# Altium schematic sheet Netscale48HD_RFID_Reader_Writer.SchDoc: RFID Reader Writer
size A3; Author: NK; CompanyName: Reichle & De-Massari; Organization: Reichle & De-Massari; Address1: Binzstrasse 32; Address2: 8620 Wetzikon; Address3: Switzerland; DocumentNumber: 4; Revision: V0.2; SheetNumber: 1; SheetTotal: 5; Organization1: Reichle & De-Massari; Size: A4; ShortDescription: MCU and RFID Reader
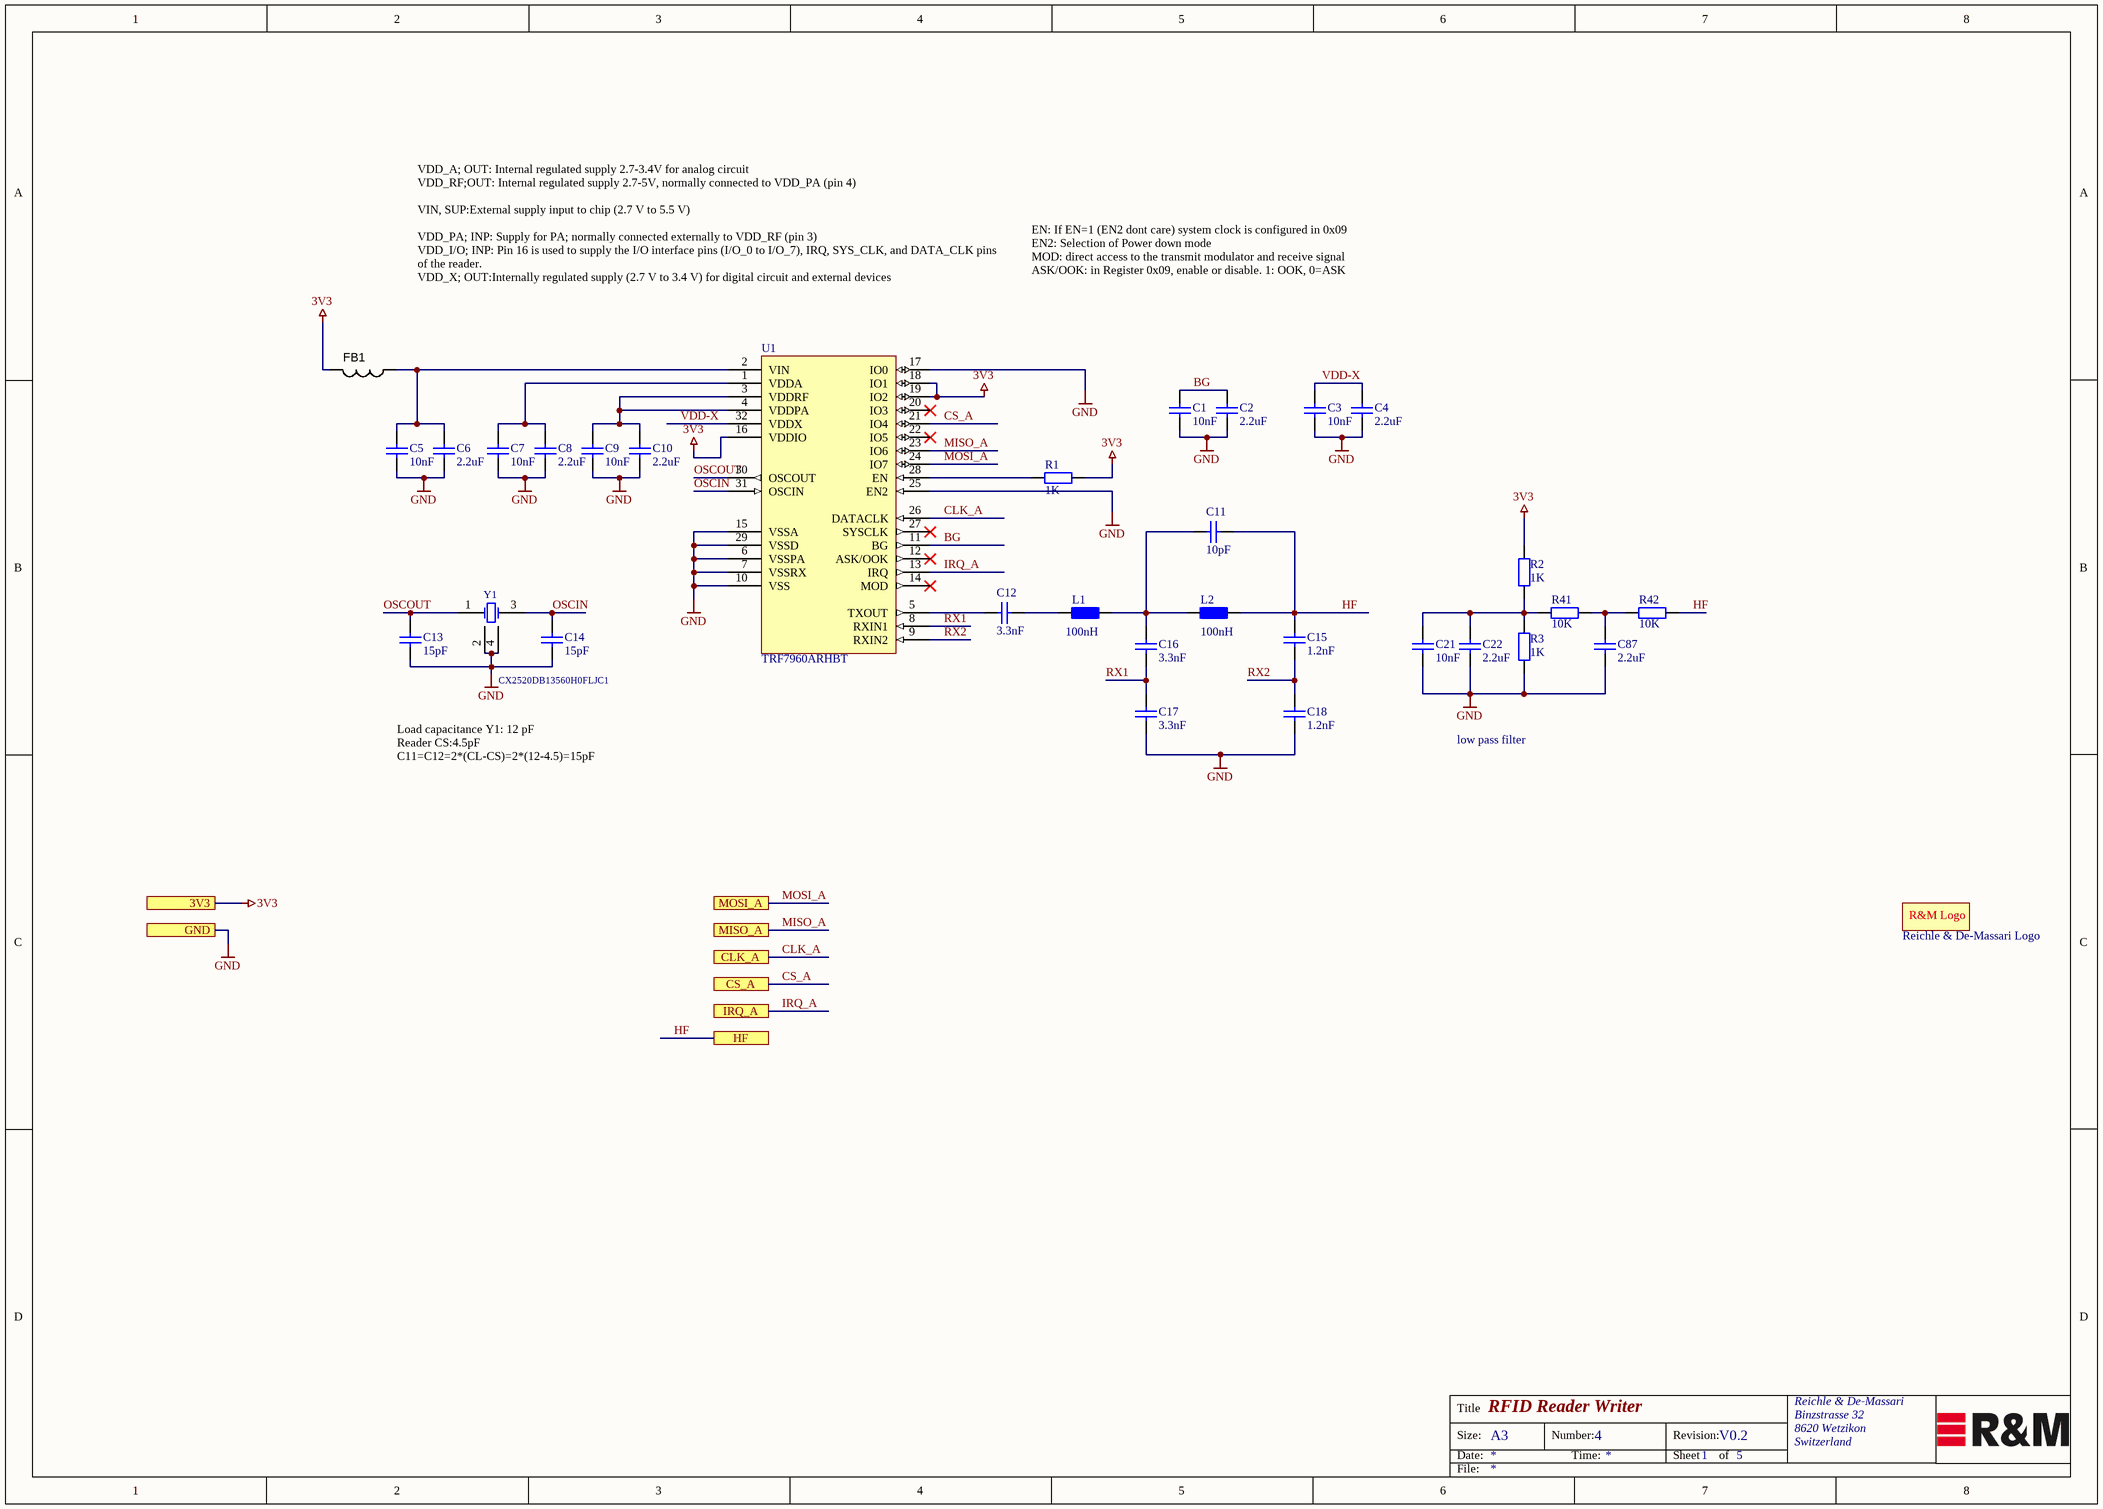
[diagram p0: Netscale48HD_RFID_Reader_Writer.SchDoc]

## Parts
*1  Reichle & De-Massari Logo  [SYMBOL_R&M]  (no BOM)
C1  10nF  [Ceramic Capacitor 0402 EIA]
C2  2.2uF  [Ceramic Capacitor 0402 EIA]
C3  10nF  [Ceramic Capacitor 0402 EIA]
C4  2.2uF  [Ceramic Capacitor 0402 EIA]
C5  10nF  [Ceramic Capacitor 0402 EIA]
C6  2.2uF  [Ceramic Capacitor 0402 EIA]
C7  10nF  [Ceramic Capacitor 0402 EIA]
C8  2.2uF  [Ceramic Capacitor 0402 EIA]
C9  10nF  [Ceramic Capacitor 0402 EIA]
C10  2.2uF  [Ceramic Capacitor 0402 EIA]
C11  10pF  [Ceramic Capacitor 0402 EIA]
C12  3.3nF  [Ceramic Capacitor 0402 EIA]
C13  15pF  [Ceramic Capacitor 0402 EIA]
C14  15pF  [Ceramic Capacitor 0402 EIA]
C15  1.2nF  [Ceramic Capacitor 0402 EIA]
C16  3.3nF  [Ceramic Capacitor 0402 EIA]
C17  3.3nF  [Ceramic Capacitor 0402 EIA]
C18  1.2nF  [Ceramic Capacitor 0402 EIA]
C21  10nF  [Ceramic Capacitor 0402 EIA]
C22  2.2uF  [Ceramic Capacitor 0402 EIA]
C87  2.2uF  [Ceramic Capacitor 0402 EIA]
FB1  BK1005HS102-T  [CAPC1005X55N]  (value not drawn)
L1  value 100nH  [Inductor 0603 EIA]  (hidden comment: HK1608R10J-T)
L2  value 100nH  [Inductor 0603 EIA]  (hidden comment: HK1608R10J-T)
R1  value 1K  [RESC1005X40N]  (hidden comment: RC0402FR-071KL)
R2  value 1K  [RESC1005X40N]  (hidden comment: RC0402FR-071KL)
R3  value 1K  [RESC1005X40N]  (hidden comment: RC0402FR-071KL)
R41  10K  [Resistor 0402 EIA]
R42  10K  [Resistor 0402 EIA]
U1  TRF7960ARHBT  [TexasInstruments_32-VFQFN_32_R]
Y1  CX2520DB13560H0FLJC1  [AVX/Kyocera_DFN4_4_RWH]

## Ports
3V3, CLK_A, CS_A, GND, HF, IRQ_A, MISO_A, MOSI_A

## Nets
3V3: FB1.2 R1.1 R2.1 U1.16(VDDIO) U1.18(IO1) U1.19(IO2) ; port 3V3
GND: C1.1 C2.1 C3.1 C4.1 C5.1 C6.1 C7.1 C8.1 C9.1 C10.1 C13.1 C14.1 C17.1 C18.1 C21.1 C22.1 C87.1 R3.2 U1.6(VSSPA) U1.7(VSSRX) U1.10(VSS) U1.15(VSSA) U1.17(IO0) U1.25(EN2) U1.29(VSSD) Y1.2(OSC2) Y1.4(OSC3) ; port GND
BG: C1.2 C2.2 U1.11(BG)
CLK_A: U1.26(DATACLK) ; port CLK_A
CS_A: U1.21(IO4) ; port CS_A
HF: C11.1 C15.2 L2.2 R42.2 ; port HF
IRQ_A: U1.13(IRQ) ; port IRQ_A
MISO_A: U1.23(IO6) ; port MISO_A
MOSI_A: U1.24(IO7) ; port MOSI_A
OSCIN: C14.2 U1.31(OSCIN) Y1.3(OSC2)
OSCOUT: C13.2 U1.30(OSCOUT) Y1.1(OSC1)
RX1: C16.1 C17.2 U1.8(RXIN1)
RX2: C15.1 C18.2 U1.9(RXIN2)
VDD-X: C3.2 C4.2 U1.32(VDDX)
NetC5_2: C5.2 C6.2 FB1.1 U1.2(VIN)
NetC7_2: C7.2 C8.2 U1.1(VDDA)
NetC9_2: C9.2 C10.2 U1.3(VDDRF) U1.4(VDDPA)
NetC11_2: C11.2 C16.2 L1.2 L2.1
NetC12_1: C12.1 L1.1
NetC12_2: C12.2 U1.5(TXOUT)
NetC21_2: C21.2 C22.2 R2.2 R3.1 R41.1
NetC87_2: C87.2 R41.2 R42.1
NetR1_2: R1.2 U1.28(EN)

Not connected (* = marked no-connect by the designer): U1 12(ASK/OOK)* 14(MOD)* 20(IO3)* 22(IO5)* 27(SYSCLK)*

## Notes on the sheet
- VDD_A; OUT: Internal regulated supply 2.7-3.4V for analog circuit
  VDD_RF;OUT: Internal regulated supply 2.7-5V, normally connected to VDD_PA (pin 4)
  VIN, SUP:External supply input to chip (2.7 V to 5.5 V)
  VDD_PA; INP: Supply for PA; normally connected externally to VDD_RF (pin 3)
  VDD_I/O; INP: Pin 16 is used to supply the I/O interface pins (I/O_0 to I/O_7), IRQ, SYS_CLK, and DATA_CLK pins of the reader.
  VDD_X; OUT:Internally regulated supply (2.7 V to 3.4 V) for digital circuit and external devices
- EN: If EN=1 (EN2 dont care) system clock is configured in 0x09
  EN2: Selection of Power down mode
  MOD: direct access to the transmit modulator and receive signal
  ASK/OOK: in Register 0x09, enable or disable. 1: OOK, 0=ASK
- Load capacitance Y1: 12 pF
  Reader CS:4.5pF
  C11=C12=2*(CL-CS)=2*(12-4.5)=15pF
- low pass filter
- Title
- Size:
- Date:
- A3
- Number:
- Time:
- Revision:
- Sheet
- of
- File:
- (in symbol SYMBOL_R&M) R&M Logo

## Library data of the parts
*1 = SYMBOL_R&M: Replaceable: no; Footprint/Package: 2.54mm
C1 C3 C5 C7 C9 C21 = Cap_10nF_0402: 10000pF ±10% 50V Keramikkondensatoren X7R 0402 (1005 metrisch) CL05B103KB5NNNC; Manufacturer: Samsung Electro-Mechanics; Replaceable: yes; tolerance: ±10%; voltage: 50V; Dielectric Grade: X7R; Footprint/Package: 0402; Supplier Part Number 1: 1276-1028-2-ND; Supplier 1: Digi-Key; Manufacturer PartNr: CL05B103KB5NNNC; value: 10nF
C2 C4 C6 C8 C10 C22 C87 = Cap_2.2uF_0402_6.3V: Multilayer Ceramic Capacitors MLCC - SMD/SMT 0402 2.2uF 6.3volts *Derate Voltage/Temp; Manufacturer: Murata; Manufacturer PartNr: GRM155R60J225ME15D; tolerance: ±20%; voltage: 6.3V; Replaceable: yes; Dielectric Grade: X5R; value: 2.2uF; Footprint/Package: 0402; ComponentLink1Description: digikey; ComponentLink1URL: https://www.digikey.com/product-detail/en/murata-electronics-north-america/GRM155R61E225ME15D/490-10457-2-ND/5027542; Supplier 1: Mouser; Supplier Part Number 1: 81-GRM155R60J225ME5D
C11 = Cap_10pF_0402: Multilayer Ceramic Capacitors MLCC - SMD/SMT 0402 10pF 50Volts C0G 1%; Manufracturer: Murata Electronics; Manufacturer PartNr: GJM1555C1H100FB01D; voltage: 50VDC; Replaceable: yes; Dielectric Grade: C0G (NP0); tolerance: 1%; ComponentLink1Description: mouser; ComponentLink1URL: https://www.mouser.ch/ProductDetail/Murata-Electronics/GRM155R60J475ME47D?qs=sGAEpiMZZMs0AnBnWHyRQIE6q%2f4qwWvwbJmEUwav8%2f4%3d; Footprint/Package: 0402 (1005 metric); Supplier 1: Mouser; Supplier Part Number 1: 81-GJM1555C1H100FB01; value: 10pF
C12 C16 C17 = Cap_3.3nF_0402: Multilayer Ceramic Capacitors MLCC - SMD/SMT 0402 3300pF 50volts X7R 5%; Manufracturer: Murata Electronics; Manufacturer PartNr: GCM155R71H332JA37D; voltage: 50VDC; Replaceable: yes; tolerance: 5%; ComponentLink1Description: mouser; ComponentLink1URL: https://www.mouser.ch/ProductDetail/Murata-Electronics/GRM155R60J475ME47D?qs=sGAEpiMZZMs0AnBnWHyRQIE6q%2f4qwWvwbJmEUwav8%2f4%3d; Dielectric Grade: X7R; Footprint/Package: 0402 (1005 metric); Supplier 1: Mouser; Supplier Part Number 1: 81-GCM155R71H332JA7D; value: 3.3nF
C13 C14 = Cap_15pF_0402: Multilayer Ceramic Capacitors MLCC - SMD/SMT 0402 15pF 50Volts C0G 5%; Manufacturer: Muarata; Manufacturer PartNr: GJM1555C1H150FB01D; voltage: 50V; Replaceable: no; Dielectric Grade: C0G (NP0); value: 15pF; tolerance: ±5%; Footprint/Package: 0402; ComponentLink1Description: digikey; ComponentLink1URL: https://www.digikey.com/product-detail/en/murata-electronics-north-america/GJM1555C1H150FB01D/490-11191-6-ND/5333833
C15 C18 = Cap_1.2nF_0402: Multilayer Ceramic Capacitors MLCC - SMD/SMT 50V 1200pF C0G 0402 5%; Manufracturer: Kemet; Manufacturer PartNr: C0402C122J5GACTU; voltage: 50VDC; Replaceable: yes; tolerance: 5%; ComponentLink1Description: mouser; ComponentLink1URL: https://www.mouser.ch/ProductDetail/Murata-Electronics/GRM155R60J475ME47D?qs=sGAEpiMZZMs0AnBnWHyRQIE6q%2f4qwWvwbJmEUwav8%2f4%3d; Dielectric Grade: C0G; Footprint/Package: 0402 (1005 metric); Supplier 1: Mouser; Supplier Part Number 1: 80-C0402C122J5G; value: 1.2nF
FB1 = FERRITE_2K2-100MHz_0603: FERRITE BEAD 1 KOHM 0402 1LN; Manufacturer: Taiyo Yuden; Manufacturer PartNr: BK1005HS102-T
L1 L2 = 706xx_R+M_InteliPhyII_KTI-00029-A.1: 100nH Unshielded Multilayer Inductor 300mA 100 mOhm Max 0603 (1608 Metric); Manufacturer: Taiyo Yuden; Manufacturer PartNr: HK1608R10J-T
R1 = PassResBas0201-00654-A.2: RES SMD 1K OHM 1% 1/16W 0402; Manufacturer: Yageo; #ClassSub: Resistor SMD; #Class: Passiv-Components; Status: nLager; Manufacturer PartNr: RC0402FR-071KL
R2 R3 = PassResBas0201-00654-A.2: RES SMD 1K OHM 1% 1/16W 0402; Manufacturer: Yageo; ValueAddON: 0.05W 5%; #ClassSub: Resistor SMD; #Class: Passiv-Components; Status: nLager; Manufacturer PartNr: RC0402FR-071KL
R41 R42 = Res_10K_0402: SMD 10K ohm 1% 50V General Purpose; Manufacturer: Yageo; Manufacturer PartNr: RC0402FR-1010KL; power: 63mW; Replaceable: yes; value: 10K; tolerance: 1%; ComponentLink1Description: mouser; ComponentLink1URL: https://www.mouser.ch/ProductDetail/Yageo/RC0402FR-1010KL?qs=sGAEpiMZZMtlubZbdhIBIEgN9MQql2m6Sb2LnYlCICU%3d; Footprint/Package: 0402; Supplier 1: Mouser; Supplier Part Number 1: 603-RC0402FR-1010KL
U1 = TexasInstruments_TRF7960ARHBT_32-VFQFN_32: Manufacturer: Texas Instruments; Manufacturer PartNr: TRF7960ARHBT
Y1 = CRYSTAL_4Pin_1_3_1: 13.56MHz ±10ppm Crystal 12pF 150 Ohms 4-SMD, No Lead; Manufacturer: Kyocera International Inc. Electronic Components; Manufacturer PartNr: CX2520DB13560H0FLJC1